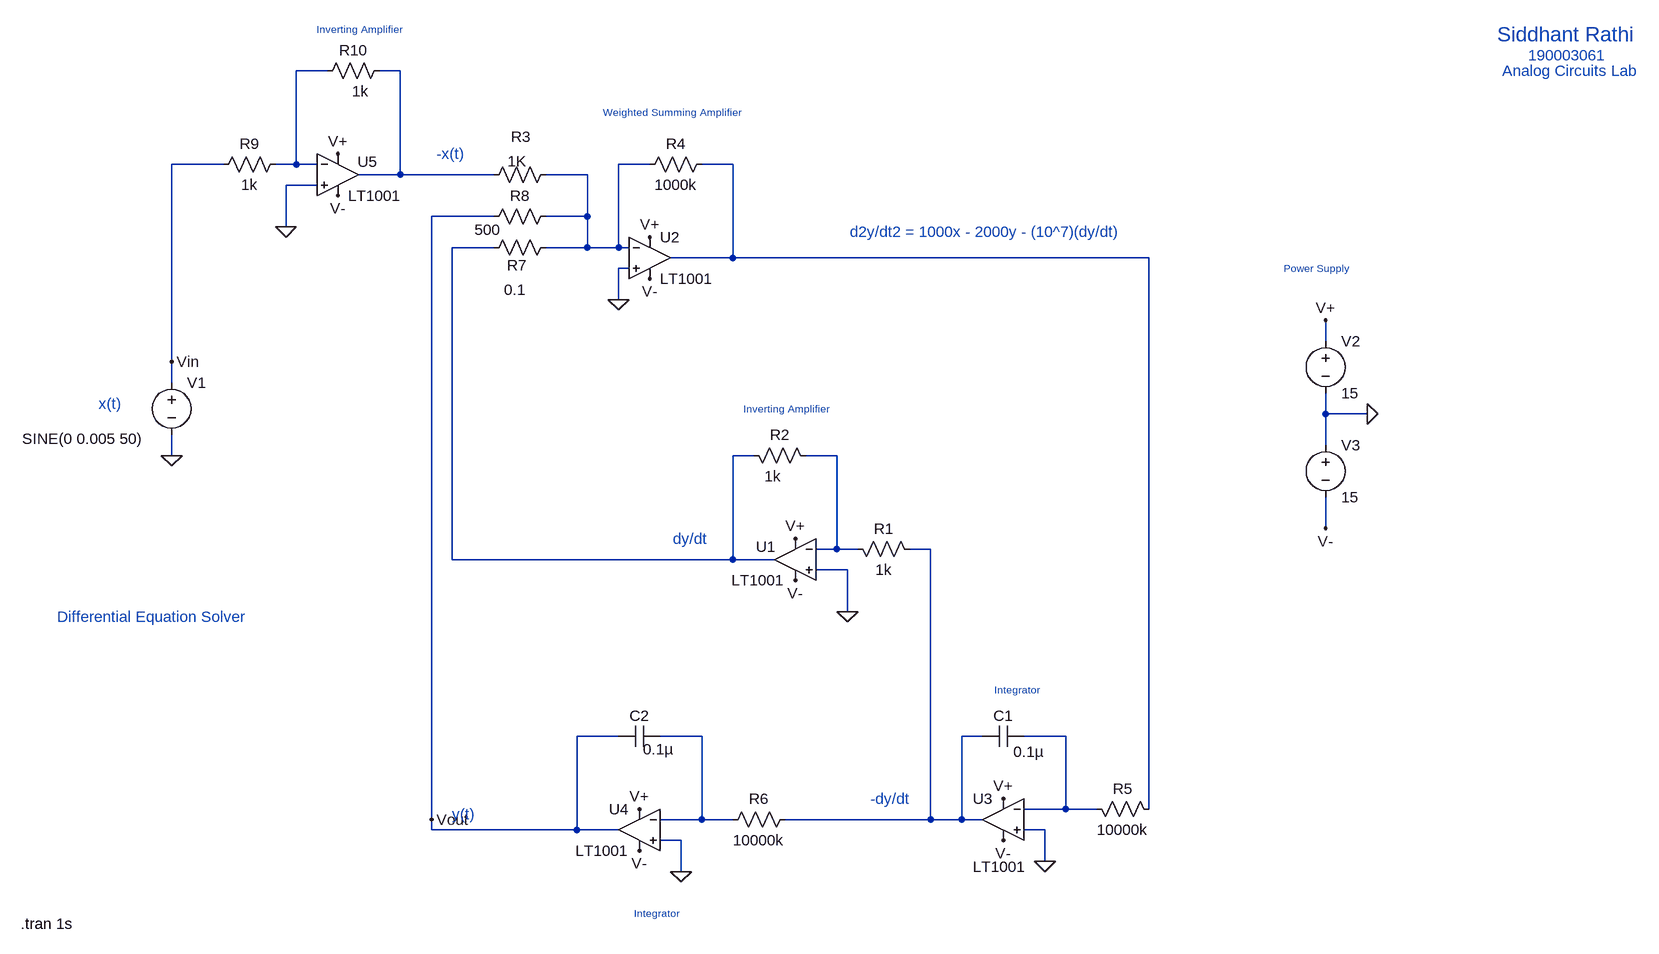
[diagram p0: schematic DifferentialEqnSolver2.asc]
DifferentialEqnSolver2.asc, the LTspice schematic file:
Version 4
SHEET 1 2104 1280
WIRE -336 -48 -384 -48
WIRE -224 -48 -256 -48
WIRE -496 96 -576 96
WIRE -384 96 -384 -48
WIRE -384 96 -416 96
WIRE -352 96 -384 96
WIRE 160 96 112 96
WIRE 288 96 240 96
WIRE -224 112 -224 -48
WIRE -224 112 -288 112
WIRE -80 112 -224 112
WIRE 64 112 0 112
WIRE -352 128 -400 128
WIRE -80 176 -176 176
WIRE 64 176 64 112
WIRE 64 176 0 176
WIRE -400 192 -400 128
WIRE -80 224 -144 224
WIRE 64 224 64 176
WIRE 64 224 0 224
WIRE 112 224 112 96
WIRE 112 224 64 224
WIRE 128 224 112 224
WIRE 288 240 288 96
WIRE 288 240 192 240
WIRE 928 240 288 240
WIRE 128 256 112 256
WIRE 112 304 112 256
WIRE 1200 368 1200 336
WIRE -576 400 -576 96
WIRE -576 432 -576 400
WIRE 1200 480 1200 448
WIRE 1264 480 1200 480
WIRE 1200 528 1200 480
WIRE -576 544 -576 512
WIRE 320 544 288 544
WIRE 448 544 400 544
WIRE 1200 656 1200 608
WIRE 448 688 448 544
WIRE 448 688 416 688
WIRE 480 688 448 688
WIRE 592 688 560 688
WIRE -144 704 -144 224
WIRE 288 704 288 544
WIRE 288 704 -144 704
WIRE 352 704 288 704
WIRE 464 720 416 720
WIRE 464 784 464 720
WIRE 112 976 48 976
WIRE 240 976 176 976
WIRE 672 976 640 976
WIRE 800 976 736 976
WIRE 800 1088 800 976
WIRE 800 1088 736 1088
WIRE 848 1088 800 1088
WIRE 928 1088 928 240
WIRE -176 1104 -176 176
WIRE 240 1104 240 976
WIRE 240 1104 176 1104
WIRE 288 1104 240 1104
WIRE 592 1104 592 688
WIRE 592 1104 368 1104
WIRE 640 1104 640 976
WIRE 640 1104 592 1104
WIRE 672 1104 640 1104
WIRE -176 1120 -176 1104
WIRE 48 1120 48 976
WIRE 48 1120 -176 1120
WIRE 112 1120 48 1120
WIRE 768 1120 736 1120
WIRE 208 1136 176 1136
WIRE 768 1168 768 1120
WIRE 208 1184 208 1136
FLAG 112 304 0
FLAG 768 1168 0
FLAG 208 1184 0
FLAG -576 544 0
FLAG 1264 480 0
FLAG 1200 336 V+
FLAG 144 1088 V+
FLAG 704 1072 V+
FLAG 160 208 V+
FLAG 1200 656 V-
FLAG 144 1152 V-
FLAG 704 1136 V-
FLAG 160 272 V-
FLAG -576 400 Vin
FLAG -176 1104 Vout
FLAG -400 192 0
FLAG -320 80 V+
FLAG -320 144 V-
FLAG 464 784 0
FLAG 384 672 V+
FLAG 384 736 V-
SYMBOL res 16 96 R90
WINDOW 0 -27 54 VBottom 2
WINDOW 3 -20 60 VTop 2
SYMATTR InstName R3
SYMATTR Value 1K
SYMBOL OpAmps\\LT1001 160 176 R0
SYMATTR InstName U2
SYMBOL res 256 80 R90
WINDOW 0 0 56 VBottom 2
WINDOW 3 32 56 VTop 2
SYMATTR InstName R4
SYMATTR Value 1000k
SYMBOL cap 672 960 M90
WINDOW 0 0 32 VBottom 2
WINDOW 3 24 71 VTop 2
SYMATTR InstName C1
SYMATTR Value 0.1µ
SYMBOL OpAmps\\LT1001 704 1040 M0
WINDOW 3 -36 137 Left 2
SYMATTR InstName U3
SYMBOL cap 112 960 M90
WINDOW 0 0 32 VBottom 2
WINDOW 3 20 61 VTop 2
SYMATTR InstName C2
SYMATTR Value 0.1µ
SYMBOL OpAmps\\LT1001 144 1056 M0
SYMATTR InstName U4
SYMBOL voltage -576 416 R0
WINDOW 3 -230 102 Left 2
WINDOW 123 0 0 Left 0
WINDOW 39 0 0 Left 0
SYMATTR Value SINE(0 0.005 50)
SYMATTR InstName V1
SYMBOL voltage 1200 352 R0
WINDOW 123 0 0 Left 0
WINDOW 39 0 0 Left 0
SYMATTR InstName V2
SYMATTR Value 15
SYMBOL voltage 1200 512 R0
SYMATTR InstName V3
SYMATTR Value 15
SYMBOL res 16 208 R90
WINDOW 0 59 60 VBottom 2
WINDOW 3 65 63 VTop 2
SYMATTR InstName R7
SYMATTR Value 0.1
SYMBOL res 16 160 R90
WINDOW 0 0 56 VBottom 2
WINDOW 3 21 105 VTop 2
SYMATTR InstName R8
SYMATTR Value 500
SYMBOL res 384 1088 R90
WINDOW 0 0 56 VBottom 2
WINDOW 3 32 56 VTop 2
SYMATTR InstName R6
SYMATTR Value 10000k
SYMBOL res 832 1072 M90
WINDOW 0 0 56 VBottom 2
WINDOW 3 32 56 VTop 2
SYMATTR InstName R5
SYMATTR Value 10000k
SYMBOL res -400 80 R90
WINDOW 0 0 56 VBottom 2
WINDOW 3 32 56 VTop 2
SYMATTR InstName R9
SYMATTR Value 1k
SYMBOL OpAmps\\LT1001 -320 48 R0
WINDOW 0 30 44 Left 2
SYMATTR InstName U5
SYMBOL res -240 -64 R90
WINDOW 0 0 56 VBottom 2
WINDOW 3 32 45 VTop 2
SYMATTR InstName R10
SYMATTR Value 1k
SYMBOL res 464 672 M90
WINDOW 0 0 56 VBottom 2
WINDOW 3 32 56 VTop 2
SYMATTR InstName R1
SYMATTR Value 1k
SYMBOL OpAmps\\LT1001 384 640 M0
WINDOW 0 30 44 Left 2
SYMATTR InstName U1
SYMBOL res 304 528 M90
WINDOW 0 0 56 VBottom 2
WINDOW 3 32 45 VTop 2
SYMATTR InstName R2
SYMATTR Value 1k
TEXT 760 904 Right 1 ;Integrator
TEXT 136 1248 Left 1 ;Integrator
TEXT 88 16 Left 1 ;Weighted Summing Amplifier
TEXT 1136 256 Left 1 ;Power Supply
TEXT -688 464 Left 2 ;x(t)
TEXT 888 200 Right 2 ;d2y/dt2 = 1000x - 2000y - (10^7)(dy/dt)
TEXT 560 1072 Right 2 ;-dy/dt
TEXT -144 1096 Left 2 ;y(t)
TEXT -224 -112 Right 1 ;Inverting Amplifier
TEXT -168 80 Left 2 ;-x(t)
TEXT 304 472 Left 1 ;Inverting Amplifier
TEXT 248 672 Right 2 ;dy/dt
TEXT -752 792 Left 2 ;Differential Equation Solver
TEXT 1464 -104 Left 3 ;Siddhant Rathi
TEXT 1512 -72 Left 2 ;190003061
TEXT 1472 -48 Left 2 ;Analog Circuits Lab
TEXT -808 1264 Left 2 !.tran 1s

The netlist it stands for:
* DifferentialEqnSolver2.asc
R3 N003 N002 1K
XU2 0 N003 V+ V- N004 LT1001  ; pins In+ In- V+ V- OUT
R4 N004 N003 1000k
C1 N007 N009 0.1µ
XU3 0 N009 V+ V- N007 LT1001  ; pins In+ In- V+ V- OUT
C2 Vout N008 0.1µ
XU4 0 N008 V+ V- Vout LT1001  ; pins In+ In- V+ V- OUT
V1 Vin 0 SINE(0 0.005 50)
V2 V+ 0 15
V3 0 V- 15
R7 N003 N005 0.1
R8 N003 Vout 500
R6 N007 N008 10000k
R5 N009 N004 10000k
R9 N001 Vin 1k
XU5 0 N001 V+ V- N002 LT1001  ; pins In+ In- V+ V- OUT
R10 N002 N001 1k
R1 N006 N007 1k
XU1 0 N006 V+ V- N005 LT1001  ; pins In+ In- V+ V- OUT
R2 N005 N006 1k
* Integrator
* Integrator
* Weighted Summing Amplifier
* Power Supply
* x(t)
* d2y/dt2 = 1000x - 2000y - (10^7)(dy/dt)
* -dy/dt
* y(t)
* Inverting Amplifier
* -x(t)
* Inverting Amplifier
* dy/dt
* Differential Equation Solver
* Siddhant Rathi
* 190003061
* Analog Circuits Lab
.tran 1s
.lib LTC.lib
.backanno
.end